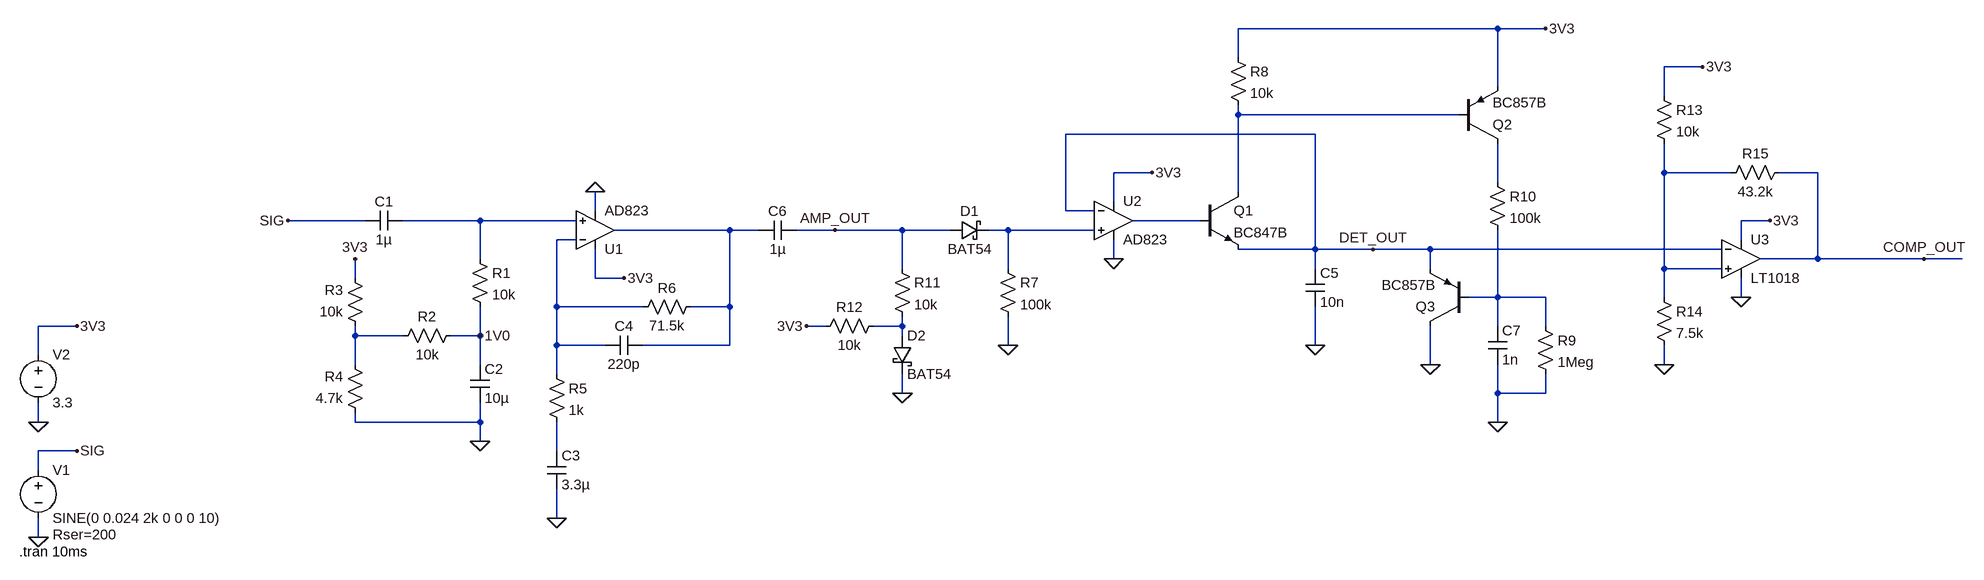
[diagram p0: schematic Sound_detector.asc]
Sound_detector.asc, the LTspice schematic file:
Version 4
SHEET 1 2628 712
WIRE 1696 -176 1264 -176
WIRE 1776 -176 1696 -176
WIRE 1264 -128 1264 -176
WIRE 2096 -112 2032 -112
WIRE 1696 -80 1696 -176
WIRE 2032 -64 2032 -112
WIRE 1264 -32 1264 -48
WIRE 1632 -32 1264 -32
WIRE 1392 0 976 0
WIRE 1120 64 1056 64
WIRE 2032 64 2032 16
WIRE 2144 64 2032 64
WIRE 2288 64 2224 64
WIRE 1696 80 1696 16
WIRE 1264 96 1264 -32
WIRE 1056 112 1056 64
WIRE 192 128 192 96
WIRE 976 128 976 0
WIRE 1024 128 976 128
WIRE -192 144 -320 144
WIRE 0 144 -128 144
WIRE 160 144 0 144
WIRE 1200 144 1088 144
WIRE 2208 144 2160 144
WIRE 416 160 224 160
WIRE 464 160 416 160
WIRE 592 160 528 160
WIRE 704 160 592 160
WIRE 784 160 704 160
WIRE 880 160 848 160
WIRE 1024 160 880 160
WIRE 160 176 128 176
WIRE 2160 176 2160 144
WIRE 1392 192 1392 0
WIRE 1392 192 1264 192
WIRE 1488 192 1392 192
WIRE 1584 192 1488 192
WIRE 2128 192 1584 192
WIRE 0 208 0 144
WIRE 1056 208 1056 176
WIRE 2288 208 2288 64
WIRE 2288 208 2192 208
WIRE 2480 208 2288 208
WIRE 2544 208 2480 208
WIRE 704 224 704 160
WIRE 880 224 880 160
WIRE 1392 224 1392 192
WIRE 1584 224 1584 192
WIRE 2032 224 2032 64
WIRE 2128 224 2032 224
WIRE -208 240 -208 208
WIRE 192 240 192 192
WIRE 240 240 192 240
WIRE 1696 272 1696 160
WIRE 1696 272 1648 272
WIRE 1776 272 1696 272
WIRE 2032 272 2032 224
WIRE 2160 272 2160 240
WIRE 128 288 128 176
WIRE 272 288 128 288
WIRE 416 288 416 160
WIRE 416 288 352 288
WIRE -672 320 -736 320
WIRE 576 320 544 320
WIRE 704 320 704 304
WIRE 704 320 656 320
WIRE 1696 320 1696 272
WIRE 1776 320 1776 272
WIRE -208 336 -208 320
WIRE -128 336 -208 336
WIRE 0 336 0 288
WIRE 0 336 -48 336
WIRE 704 336 704 320
WIRE 128 352 128 288
WIRE 208 352 128 352
WIRE 416 352 416 288
WIRE 416 352 272 352
WIRE 880 352 880 304
WIRE 1392 352 1392 288
WIRE -736 368 -736 320
WIRE -208 384 -208 336
WIRE 0 384 0 336
WIRE 1584 384 1584 320
WIRE 2032 384 2032 352
WIRE 128 400 128 352
WIRE 704 432 704 400
WIRE 1696 432 1696 384
WIRE 1776 432 1776 400
WIRE 1776 432 1696 432
WIRE -736 480 -736 448
WIRE -208 480 -208 464
WIRE 0 480 0 448
WIRE 0 480 -208 480
WIRE 1696 480 1696 432
WIRE 0 512 0 480
WIRE -672 528 -736 528
WIRE 128 528 128 480
WIRE -736 560 -736 528
WIRE 128 640 128 592
WIRE -736 672 -736 640
FLAG -736 672 0
FLAG -672 528 SIG
FLAG -320 144 SIG
FLAG 0 512 0
FLAG -736 480 0
FLAG -672 320 3V3
FLAG -208 208 3V3
FLAG 128 640 0
FLAG 592 160 AMP_OUT
FLAG 192 96 0
FLAG 240 240 3V3
FLAG 0 336 1V0
FLAG 1392 352 0
FLAG 1056 208 0
FLAG 1120 64 3V3
FLAG 880 352 0
FLAG 2208 144 3V3
FLAG 2160 272 0
FLAG 1696 480 0
FLAG 1584 384 0
FLAG 1776 -176 3V3
FLAG 1488 192 DET_OUT
FLAG 2480 208 COMP_OUT
FLAG 704 432 0
FLAG 544 320 3V3
FLAG 2032 384 0
FLAG 2096 -112 3V3
SYMBOL voltage -736 544 R0
WINDOW 123 0 0 Left 0
WINDOW 39 24 124 Left 2
SYMATTR SpiceLine Rser=200
SYMATTR InstName V1
SYMATTR Value SINE(0 0.024 2k 0 0 0 10)
SYMBOL cap -128 128 R90
WINDOW 0 0 32 VBottom 2
WINDOW 3 32 32 VTop 2
SYMATTR InstName C1
SYMATTR Value 1µ
SYMBOL OpAmps\\AD823 192 224 M180
SYMATTR InstName U1
SYMBOL res -16 192 R0
SYMATTR InstName R1
SYMATTR Value 10k
SYMBOL cap -16 384 R0
SYMATTR InstName C2
SYMATTR Value 10µ
SYMBOL res -32 320 R90
WINDOW 0 0 56 VBottom 2
WINDOW 3 32 56 VTop 2
SYMATTR InstName R2
SYMATTR Value 10k
SYMBOL res -192 336 R180
WINDOW 0 36 76 Left 2
WINDOW 3 36 40 Left 2
SYMATTR InstName R3
SYMATTR Value 10k
SYMBOL res -192 480 R180
WINDOW 0 36 76 Left 2
WINDOW 3 36 40 Left 2
SYMATTR InstName R4
SYMATTR Value 4.7k
SYMBOL voltage -736 352 R0
WINDOW 123 0 0 Left 0
WINDOW 39 0 0 Left 0
SYMATTR InstName V2
SYMATTR Value 3.3
SYMBOL res 112 384 R0
SYMATTR InstName R5
SYMATTR Value 1k
SYMBOL cap 112 528 R0
SYMATTR InstName C3
SYMATTR Value 3.3µ
SYMBOL cap 272 336 R90
WINDOW 0 0 32 VBottom 2
WINDOW 3 32 32 VTop 2
SYMATTR InstName C4
SYMATTR Value 220p
SYMBOL res 368 272 R90
WINDOW 0 0 56 VBottom 2
WINDOW 3 32 56 VTop 2
SYMATTR InstName R6
SYMATTR Value 71.5k
SYMBOL cap 1376 224 R0
SYMATTR InstName C5
SYMATTR Value 10n
SYMBOL cap 528 144 R90
WINDOW 0 0 32 VBottom 2
WINDOW 3 32 32 VTop 2
SYMATTR InstName C6
SYMATTR Value 1µ
SYMBOL OpAmps\\AD823 1056 80 R0
SYMATTR InstName U2
SYMBOL res 864 208 R0
SYMATTR InstName R7
SYMATTR Value 100k
SYMBOL Comparators\\LT1018 2160 208 R0
SYMATTR InstName U3
SYMBOL npn 1200 96 R0
SYMATTR InstName Q1
SYMATTR Value BC847B
SYMBOL res 1248 -144 R0
SYMATTR InstName R8
SYMATTR Value 10k
SYMBOL cap 1680 320 R0
SYMATTR InstName C7
SYMATTR Value 1n
SYMBOL res 1760 304 R0
SYMATTR InstName R9
SYMATTR Value 1Meg
SYMBOL pnp 1648 320 R180
SYMATTR InstName Q3
SYMATTR Value BC857B
SYMBOL pnp 1632 16 M180
SYMATTR InstName Q2
SYMATTR Value BC857B
SYMBOL schottky 784 176 R270
WINDOW 0 32 32 VTop 2
WINDOW 3 0 32 VBottom 2
SYMATTR InstName D1
SYMATTR Value BAT54
SYMATTR Description Diode
SYMATTR Type diode
SYMBOL schottky 688 336 R0
SYMATTR InstName D2
SYMATTR Value BAT54
SYMATTR Description Diode
SYMATTR Type diode
SYMBOL res 688 208 R0
SYMATTR InstName R11
SYMATTR Value 10k
SYMBOL res 672 304 R90
WINDOW 0 0 56 VBottom 2
WINDOW 3 32 56 VTop 2
SYMATTR InstName R12
SYMATTR Value 10k
SYMBOL res 2016 -80 R0
SYMATTR InstName R13
SYMATTR Value 10k
SYMBOL res 2016 256 R0
SYMATTR InstName R14
SYMATTR Value 7.5k
SYMBOL res 2240 48 R90
WINDOW 0 0 56 VBottom 2
WINDOW 3 32 56 VTop 2
SYMATTR InstName R15
SYMATTR Value 43.2k
SYMBOL res 1680 64 R0
SYMATTR InstName R10
SYMATTR Value 100k
TEXT -768 696 Left 2 !.tran 10ms

The netlist it stands for:
* Sound_detector.asc
V1 SIG 0 SINE(0 0.024 2k 0 0 0 10) Rser=200
C1 N004 SIG 1µ
XU1 N004 N008 3V3 0 N006 AD823  ; pins In+ In- V+ V- OUT
R1 N004 1V0 10k
C2 1V0 0 10µ
R2 1V0 N011 10k
R3 N011 3V3 10k
R4 0 N011 4.7k
V2 3V3 0 3.3
R5 N008 N012 1k
C3 N012 0 3.3µ
C4 N006 N008 220p
R6 N006 N008 71.5k
C5 DET_OUT 0 10n
C6 AMP_OUT N006 1µ
XU2 N007 DET_OUT 3V3 0 N005 AD823  ; pins In+ In- V+ V- OUT
R7 N007 0 100k
XU3 N002 DET_OUT 3V3 0 COMP_OUT LT1018  ; pins In+ In- V+ V- OUT
Q1 N001 N005 DET_OUT 0 BC847B
R8 3V3 N001 10k
C7 N009 0 1n
R9 N009 0 1Meg
Q3 0 N009 DET_OUT 0 BC857B
Q2 N003 N001 3V3 0 BC857B
D1 AMP_OUT N007 BAT54
D2 N010 0 BAT54
R11 AMP_OUT N010 10k
R12 N010 3V3 10k
R13 3V3 N002 10k
R14 N002 0 7.5k
R15 COMP_OUT N002 43.2k
R10 N003 N009 100k
.model D D
.lib standard.dio
.model NPN NPN
.model PNP PNP
.lib standard.bjt
.tran 10ms
.lib ADI.lib
.lib LTC1.lib
.backanno
.end